# EAGLE board A10kalsch (EAGLE 6.5.0)
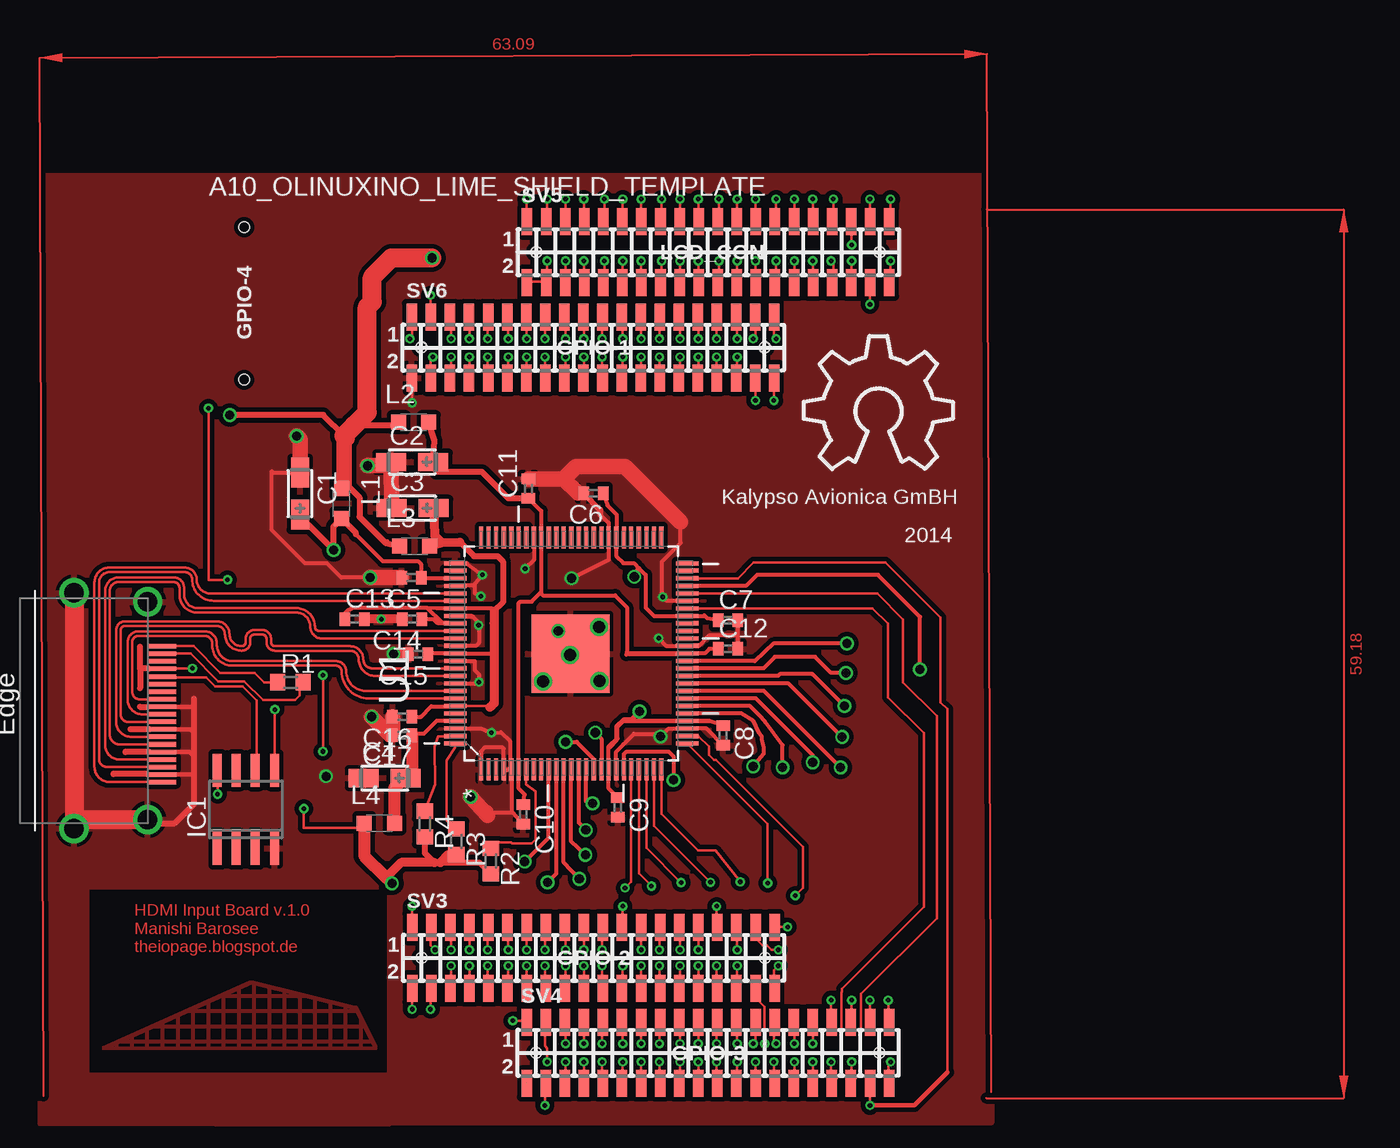
[diagram p2: board, top side]
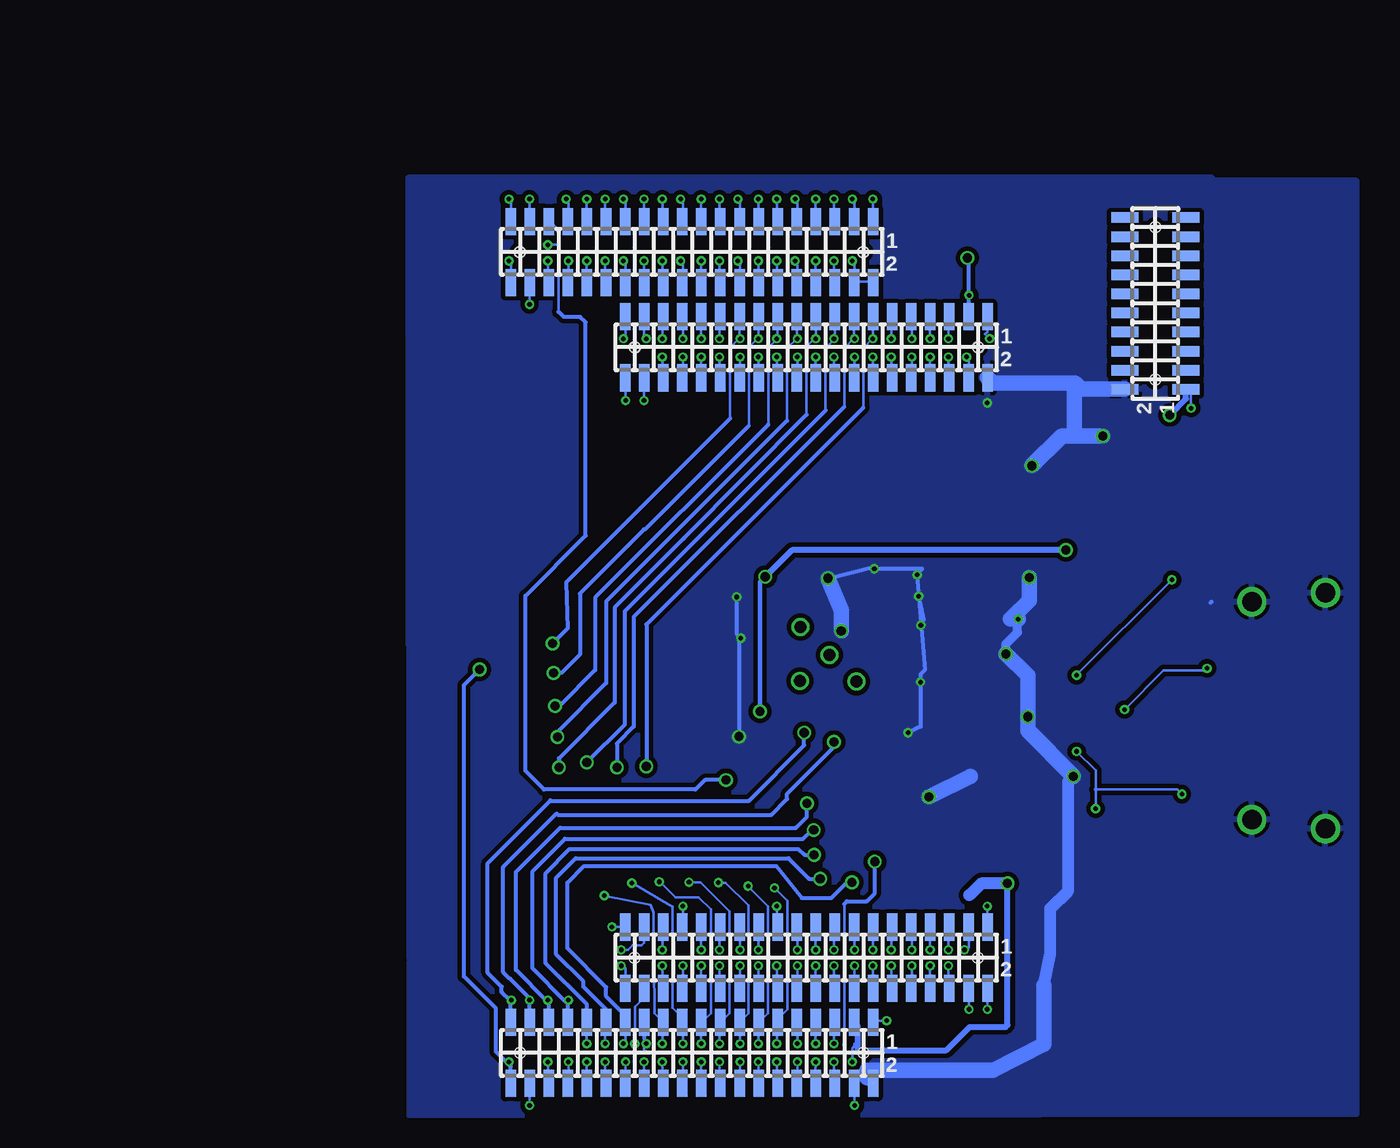
[diagram p3: board, bottom side, seen from below]

No outline drawn. Coordinates in mm, seen from the top.
Copper layers (1*16): Top 0.035mm / dielectric 1.5mm / Bottom 0.035mm
Design rules "ITEADstudio_DRC": minimum track width 6mil, minimum drill 12mil, track to track 6mil, track to pad 6mil, pad to pad 6mil, via to via 6mil, smd to smd 0mil, copper to edge 10mil, drill to drill 10mil, minimum pad ring 10mil, minimum via ring 6mil, stop-mask expansion 2mil, vias tented up to drill 100mil, thermal gap 10mil

## Footprints (pad centres in the part's own frame; a part is rotated, then mirrored left to right if it is on the bottom)
A10_OLINUXINO_LIME_SHIELD = smd 0.7 x 1.8 bottom: 1-1 -11.874,22.416; 1-2 -11.874,18.352; 1-3 -10.604,22.416; 1-4 -10.604,18.352; 1-5 -9.335,22.416; 1-6 -9.335,18.352; 1-7 -8.065,22.416; 1-8 -8.065,18.352; 1-9 -6.795,22.416; 1-10 -6.795,18.352; 1-11 -5.524,22.416; 1-12 -5.524,18.352; 1-13 -4.255,22.416; 1-14 -4.255,18.352; 1-15 -2.985,22.416; 1-16 -2.985,18.352; 1-17 -1.714,22.416; 1-18 -1.714,18.352; 1-19 -0.445,22.416; 1-20 -0.445,18.352; 1-21 0.826,22.416; 1-22 0.826,18.352; 1-23 2.095,22.416; 1-24 2.095,18.352; 1-25 3.365,22.416; 1-26 3.365,18.352; 1-27 4.636,22.416; 1-28 4.636,18.352; 1-29 5.905,22.416; 1-30 5.905,18.352; 1-31 7.176,22.416; 1-32 7.176,18.352; 1-33 8.445,22.416; 1-34 8.445,18.352; 1-35 9.716,22.416; 1-36 9.716,18.352; 1-37 10.986,22.416; 1-38 10.986,18.352; 1-39 12.255,22.416; 1-40 12.255,18.352; 2-1 -11.874,-18.224; 2-2 -11.874,-22.288; 2-3 -10.604,-18.224; 2-4 -10.604,-22.288; 2-5 -9.335,-18.224; 2-6 -9.335,-22.288; 2-7 -8.065,-18.224; 2-8 -8.065,-22.288; 2-9 -6.795,-18.224; 2-10 -6.795,-22.288; 2-11 -5.524,-18.224; 2-12 -5.524,-22.288; 2-13 -4.255,-18.224; 2-14 -4.255,-22.288; 2-15 -2.985,-18.224; 2-16 -2.985,-22.288; 2-17 -1.714,-18.224; 2-18 -1.714,-22.288; 2-19 -0.445,-18.224; 2-20 -0.445,-22.288; 2-21 0.826,-18.224; 2-22 0.826,-22.288; 2-23 2.095,-18.224; 2-24 2.095,-22.288; 2-25 3.365,-18.224; 2-26 3.365,-22.288; 2-27 4.636,-18.224; 2-28 4.636,-22.288; 2-29 5.905,-18.224; 2-30 5.905,-22.288; 2-31 7.176,-18.224; 2-32 7.176,-22.288; 2-33 8.445,-18.224; 2-34 8.445,-22.288; 2-35 9.716,-18.224; 2-36 9.716,-22.288; 2-37 10.986,-18.224; 2-38 10.986,-22.288; 2-39 12.255,-18.224; 2-40 12.255,-22.288; 3-1 -4.255,-24.575; 3-2 -4.255,-28.639; 3-3 -2.985,-24.575; 3-4 -2.985,-28.639; 3-5 -1.714,-24.575; 3-6 -1.714,-28.639; 3-7 -0.445,-24.575; 3-8 -0.445,-28.639; 3-9 0.826,-24.575; 3-10 0.826,-28.639; 3-11 2.095,-24.575; 3-12 2.095,-28.639; 3-13 3.365,-24.575; 3-14 3.365,-28.639; 3-15 4.636,-24.575; 3-16 4.636,-28.639; 3-17 5.905,-24.575; 3-18 5.905,-28.639; 3-19 7.176,-24.575; 3-20 7.176,-28.639; 3-21 8.445,-24.575; 3-22 8.445,-28.639; 3-23 9.716,-24.575; 3-24 9.716,-28.639; 3-25 10.986,-24.575; 3-26 10.986,-28.639; 3-27 12.255,-24.575; 3-28 12.255,-28.639; 3-29 13.525,-24.575; 3-30 13.525,-28.639; 3-31 14.796,-24.575; 3-32 14.796,-28.639; 3-33 16.066,-24.575; 3-34 16.066,-28.639; 3-35 17.335,-24.575; 3-36 17.335,-28.639; 3-37 18.605,-24.575; 3-38 18.605,-28.639; 3-39 19.875,-24.575; 3-40 19.875,-28.639; D-1 -4.255,28.765; D-2 -4.255,24.701; D-3 -2.985,28.765; D-4 -2.985,24.701; D-5 -1.714,28.765; D-6 -1.714,24.701; D-7 -0.445,28.765; D-8 -0.445,24.701; D-9 0.826,28.765; D-10 0.826,24.701; D-11 2.095,28.765; D-12 2.095,24.701; D-13 3.365,28.765; D-14 3.365,24.701; D-15 4.636,28.765; D-16 4.636,24.701; D-17 5.905,28.765; D-18 5.905,24.701; D-19 7.176,28.765; D-20 7.176,24.701; D-21 8.445,28.765; D-22 8.445,24.701; D-23 9.716,28.765; D-24 9.716,24.701; D-25 10.986,28.765; D-26 10.986,24.701; D-27 12.255,28.765; D-28 12.255,24.701; D-29 13.525,28.765; D-30 13.525,24.701; D-31 14.796,28.765; D-32 14.796,24.701; D-33 16.066,28.765; D-34 16.066,24.701; D-35 17.335,28.765; D-36 17.335,24.701; D-37 18.605,28.765; D-38 18.605,24.701; D-39 19.875,28.765; D-40 19.875,24.701 | smd 1.8 x 0.7 bottom: 4-1 -25.082,17.59; 4-2 -21.018,17.59; 4-3 -25.082,18.86; 4-4 -21.018,18.86; 4-5 -25.082,20.13; 4-6 -21.018,20.13; 4-7 -25.082,21.399; 4-8 -21.018,21.399; 4-9 -25.082,22.669; 4-10 -21.018,22.669; 4-11 -25.082,23.939; 4-12 -21.018,23.939; 4-13 -25.082,25.209; 4-14 -21.018,25.209; 4-15 -25.082,26.48; 4-16 -21.018,26.48; 4-17 -25.082,27.75; 4-18 -21.018,27.75; 4-19 -25.082,29.02; 4-20 -21.018,29.02 | hole 0.7: -11.239,20.384; 11.62,20.384; -11.239,-20.256; 11.62,-20.256; -3.619,-26.607; 19.241,-26.607; -3.619,26.733; 19.241,26.733; -23.05,18.224; -23.05,28.384
CT3216 = smd 2 x 1.2: + 1.4,0; - -1.4,0
C0402 = smd 0.7 x 0.9: 1 -0.65,0; 2 0.65,0
FCI-HDMI = drill 1.3: 1 1.1,7.85; 2 -3.8,7.25; 3 1.1,-7.85; 4 -3.8,-7.25 | smd 1.9 x 0.3: P$1 -4.76,4.75; P$2 -4.76,4.25; P$3 -4.76,3.75; P$4 -4.76,3.25; P$5 -4.76,2.75; P$6 -4.76,2.25; P$7 -4.76,1.75; P$8 -4.76,1.25; P$9 -4.76,0.75; P$10 -4.76,0.25; P$11 -4.76,-0.25; P$12 -4.76,-0.75; P$13 -4.76,-1.25; P$14 -4.76,-1.75; P$15 -4.76,-2.25; P$16 -4.76,-2.8; P$17 -4.76,-3.3; P$18 -4.76,-3.8; P$19 -4.76,-4.3
SO-08 = smd 0.6 x 2.2: 1 -1.905,-2.6; 2 -0.635,-2.6; 3 0.635,-2.6; 4 1.905,-2.6; 5 1.905,2.6; 6 0.635,2.6; 7 -0.635,2.6; 8 -1.905,2.6
L2012C = smd 1 x 1: 1 -1,0; 2 1,0
R0603 = smd 1 x 1.1: 1 -0.85,0; 2 0.85,0
YA-V36P-2X20-LF = smd 0.7 x 1.8: 1 -12.065,2.032; 2 -12.065,-2.032; 3 -10.795,2.032; 4 -10.795,-2.032; 5 -9.525,2.032; 6 -9.525,-2.032; 7 -8.255,2.032; 8 -8.255,-2.032; 9 -6.985,2.032; 10 -6.985,-2.032; 11 -5.715,2.032; 12 -5.715,-2.032; 13 -4.445,2.032; 14 -4.445,-2.032; 15 -3.175,2.032; 16 -3.175,-2.032; 17 -1.905,2.032; 18 -1.905,-2.032; 19 -0.635,2.032; 20 -0.635,-2.032; 21 0.635,2.032; 22 0.635,-2.032; 23 1.905,2.032; 24 1.905,-2.032; 25 3.175,2.032; 26 3.175,-2.032; 27 4.445,2.032; 28 4.445,-2.032; 29 5.715,2.032; 30 5.715,-2.032; 31 6.985,2.032; 32 6.985,-2.032; 33 8.255,2.032; 34 8.255,-2.032; 35 9.525,2.032; 36 9.525,-2.032; 37 10.795,2.032; 38 10.795,-2.032; 39 12.065,2.032; 40 12.065,-2.032 | hole 0.7: -11.43,0; 11.43,0
QFP50P1600X1600X120-101N = smd 1.473 x 0.279: 1 -7.722,5.994; 2 -7.722,5.512; 3 -7.722,5.004; 4 -7.722,4.496; 5 -7.722,3.988; 6 -7.722,3.505; 7 -7.722,2.997; 8 -7.722,2.489; 9 -7.722,2.007; 10 -7.722,1.499; 11 -7.722,0.991; 12 -7.722,0.508; 13 -7.722,0; 14 -7.722,-0.508; 15 -7.722,-0.991; 16 -7.722,-1.499; 17 -7.722,-2.007; 18 -7.722,-2.489; 19 -7.722,-2.997; 20 -7.722,-3.505; 21 -7.722,-3.988; 22 -7.722,-4.496; 23 -7.722,-5.004; 24 -7.722,-5.512; 25 -7.722,-5.994; 51 7.722,-5.994; 52 7.722,-5.512; 53 7.722,-5.004; 54 7.722,-4.496; 55 7.722,-3.988; 56 7.722,-3.505; 57 7.722,-2.997; 58 7.722,-2.489; 59 7.722,-2.007; 60 7.722,-1.499; 61 7.722,-0.991; 62 7.722,-0.508; 63 7.722,0; 64 7.722,0.508; 65 7.722,0.991; 66 7.722,1.499; 67 7.722,2.007; 68 7.722,2.489; 69 7.722,2.997; 70 7.722,3.505; 71 7.722,3.988; 72 7.722,4.496; 73 7.722,5.004; 74 7.722,5.512; 75 7.722,5.994 | smd 0.279 x 1.473: 26 -5.994,-7.722; 27 -5.512,-7.722; 28 -5.004,-7.722; 29 -4.496,-7.722; 30 -3.988,-7.722; 31 -3.505,-7.722; 32 -2.997,-7.722; 33 -2.489,-7.722; 34 -2.007,-7.722; 35 -1.499,-7.722; 36 -0.991,-7.722; 37 -0.508,-7.722; 38 0,-7.722; 39 0.508,-7.722; 40 0.991,-7.722; 41 1.499,-7.722; 42 2.007,-7.722; 43 2.489,-7.722; 44 2.997,-7.722; 45 3.505,-7.722; 46 3.988,-7.722; 47 4.496,-7.722; 48 5.004,-7.722; 49 5.512,-7.722; 50 5.994,-7.722; 76 5.994,7.722; 77 5.512,7.722; 78 5.004,7.722; 79 4.496,7.722; 80 3.988,7.722; 81 3.505,7.722; 82 2.997,7.722; 83 2.489,7.722; 84 2.007,7.722; 85 1.499,7.722; 86 0.991,7.722; 87 0.508,7.722; 88 0,7.722; 89 -0.508,7.722; 90 -0.991,7.722; 91 -1.499,7.722; 92 -2.007,7.722; 93 -2.489,7.722; 94 -2.997,7.722; 95 -3.505,7.722; 96 -3.988,7.722; 97 -4.496,7.722; 98 -5.004,7.722; 99 -5.512,7.722; 100 -5.994,7.722 | smd 5.207 x 5.207: 101 -0.025,0.051

## Placement (x,y rotation side)
A10_OLINUXINO_LIME_SHIELD  A10_OLINUXINO_LIME_SHIELD_TEMPLATE  [A10_OLINUXINO_LIME_SHIELD]  40.67,31.93 0 top
C1  22uF  [CT3216]  21.34,42.57 270 top
C2  22uF  [CT3216]  28.8,44.68 0 top
C3  22uF  [CT3216]  28.83,41.61 0 top
C4  22uF  [CT3216]  26.97,23.62 0 top
C5  0.01uf  [C0402]  28.75,36.98 180 top
C6  0.01uf  [C0402]  40.87,42.6 180 top
C7  0.01uf  [C0402]  49.83,34.14 0 top
C8  0.01uf  [C0402]  49.5,26.47 270 top
C9  0.01uf  [C0402]  42.49,21.67 270 top
C10  0.01uf  [C0402]  36.2,21.21 270 top
C11  0.01uf  [C0402]  36.55,42.9 90 top
C12  0.01uf  [C0402]  49.83,32.23 0 top
C13  0.01uf  [C0402]  24.97,34.21 0 top
C14  0.01uf  [C0402]  28.8,34.21 180 top
C15  0.01uf  [C0402]  29.21,31.88 180 top
C16  0.01uf  [C0402]  28.14,27.71 180 top
C17  [C0402]  28.14,26.49 180 top
HDMI  HDMI  [FCI-HDMI]  7.39,28.12 180 top
IC1  24AA02SN  [SO-08]  17.73,21.54 0 top
L1  0.082uH  [L2012C]  24.1,41.91 270 top
L2  0.082uH  [L2012C]  28.91,47.32 0 top
L3  0.082uH  [L2012C]  28.96,39.07 0 top
L4  0.082uH  [L2012C]  26.62,20.62 0 top
R1  4.7K  [R0603]  20.7,30 0 top
R2  4.7K  [R0603]  34.04,18.11 270 top
R3  4.7K  [R0603]  31.75,19.41 270 top
R4  4.7K  [R0603]  29.64,20.57 270 top
SV3  ML40YA-V36P-2X20-LF  [YA-V36P-2X20-LF]  40.87,11.66 0 top
SV4  ML40YA-V36P-2X20-LF  [YA-V36P-2X20-LF]  48.49,5.33 0 top
SV5  ML40YA-V36P-2X20-LF  [YA-V36P-2X20-LF]  48.51,58.65 0 top
SV6  ML40YA-V36P-2X20-LF  [YA-V36P-2X20-LF]  40.84,52.3 0 top
U1  TFP401APZP  [QFP50P1600X1600X120-101N]  39.4,31.93 90 top
U$2  [OSHW_10X350_NOTEXT]  54.89,44.2 0 top

## Tracks (layer width: path | path; a pad name or v marks a point on that pad's centre or on a via)
B0  (via drill 0.3, 0.61 pad 0.25)
  Top 0.152: SV4.25 51.66,6.1 v51.51,5.94
  Top 0.254: U1.10 37.9,19.66 v36.3,18.06
  Bottom 0.152: 38.33,5.92 38.33,15.24 | 51.65,6.31 51.65,5.94 | 51.65,5.94 51.65,5.52 51.51,5.38 38.33,5.38 38.25,5.31 | 51.65,5.94 v51.51,5.94 | 51.66,5.94 51.65,5.94
  Bottom 0.254: A10_OLINUXINO_LIME_SHIELD.3-25 51.65,6.31 | 38.25,5.31 38.33,5.92 | 38.33,15.24 38.15,15.42 36.83,15.42 36.3,15.95 v36.3,18.06
B1  (via drill 0.3, 0.61 pad 0.25)
  Top 0.152: v53.03,5.94 52.88,6.1 52.88,7.32 SV4.27
  Top 0.254: v37.82,16.69 38.41,17.27 U1.11
  Bottom 0.152: v53.03,5.94 52.88,6.1 52.88,7.32 A10_OLINUXINO_LIME_SHIELD.3-27
  Bottom 0.254: A10_OLINUXINO_LIME_SHIELD.3-27 52.92,7.84 54.18,9.09 54.18,9.7 56.77,12.29 56.77,16.66 55.65,17.78 42.88,17.78 41.15,15.62 41.12,15.65 39.19,15.65 38.15,16.69 v37.82,16.69
B2  (via drill 0.3, 0.61 pad 0.25)
  Top 0.152: v54.25,5.94 54.25,7.32 SV4.29
  Top 0.254: v39.93,16.92 38.89,18.01 U1.12
  Bottom 0.152: v54.25,5.94 54.25,7.32 A10_OLINUXINO_LIME_SHIELD.3-29
  Bottom 0.254: A10_OLINUXINO_LIME_SHIELD.3-29 54.19,8.22 55.7,9.73 55.7,10.08 57.51,11.89 57.51,16.99 56.21,18.29 42.04,18.29 40.66,16.92 v39.93,16.92
B3  (via drill 0.3, 0.61 pad 0.25)
  Top 0.152: v55.47,5.94 SV4.31
  Top 0.254: v40.34,18.52 39.4,19.41 U1.13
  Bottom 0.152: v55.47,5.94 55.47,7.32 A10_OLINUXINO_LIME_SHIELD.3-31
  Bottom 0.254: A10_OLINUXINO_LIME_SHIELD.3-31 55.46,8.55 58.22,11.3 58.22,17.3 56.62,18.9 41.4,18.9 40.97,18.52 v40.34,18.52
B4  (via drill 0.3, 0.61 pad 0.25)
  Top 0.152: v56.69,8.84 56.69,7.47 SV4.33
  Top 0.254: v40.36,20.17 39.9,20.65 U1.14
  Bottom 0.152: v56.69,8.84 56.84,8.84 56.91,8.78
  Bottom 0.254: A10_OLINUXINO_LIME_SHIELD.3-33 56.73,8.6 56.91,8.78 59.08,10.95 59.08,17.42 56.92,19.58 41.07,19.58 40.46,20.17 v40.36,20.17
B5  (via drill 0.3, 0.61 pad 0.25)
  Top 0.152: v58.06,8.84 58.06,7.47 SV4.35
  Top 0.254: v40.82,21.95 40.39,22.07 U1.15
  Bottom 0.152: v58.06,8.84 58.13,8.78
  Bottom 0.254: A10_OLINUXINO_LIME_SHIELD.3-35 58,8.65 58.13,8.78 60.2,10.85 60.2,17.37 57.25,20.32 41.55,20.32 40.82,21.06 v40.82,21.95
B6  (via drill 0.3, 0.61 pad 0.25)
  Top 0.152: v59.28,8.84 SV4.37
  Top 0.254: v39.01,26.04 39.75,26.04 40.89,24.89 U1.16
  Bottom 0.152: v59.28,8.84 59.27,8.95
  Bottom 0.254: A10_OLINUXINO_LIME_SHIELD.3-37 59.27,8.95 60.58,10.26 60.6,10.26 61.04,10.69 61.04,17.7 57.48,21.26 57.4,21.18 43.18,21.18 42.14,22.23 42.14,22.58 39.01,25.7 v39.01,26.04
B7  (via drill 0.3, 0.61 pad 0.25)
  Top 0.152: v60.5,8.84 60.5,7.47 SV4.39
  Top 0.254: v41,26.64 41.4,26.24 U1.17
  Bottom 0.152: v60.5,8.84 60.55,8.79
  Bottom 0.254: A10_OLINUXINO_LIME_SHIELD.3-39 60.54,8.78 60.55,8.79 61.14,9.37 61.14,9.73 62.08,10.67 62.08,17.96 57.89,22.15 57.86,22.12 44.68,22.12 41,25.81 v41,26.64
CK  (via drill 0.3)
  Top 0.152: U1.44 59.46,34.92 60.48,33.91 60.48,29.01 62.87,26.62 62.87,15.04 57.43,9.6 57.43,9.4 57.38,9.35 57.38,3.94 SV4.34 56.69,3.35 v56.69,4.72
  Bottom 0.152: v56.69,4.72 56.69,3.35 A10_OLINUXINO_LIME_SHIELD.3-34
DE  (via drill 0.3)
  Top 0.152: U1.46 59.77,35.92 61.49,34.19 61.49,30 63.73,27.76 63.73,14.3 58.67,9.25 58.67,3.96 58.06,3.35 | 58.06,3.35 v58.06,4.72 | 58.06,3.35 SV4.36
  Bottom 0.152: v58.06,4.72 58.06,3.35 A10_OLINUXINO_LIME_SHIELD.3-36
EINT28/SPI1_CS0/UART2_RTS/PI16  (via drill 0.3)
  Top 0.152: v53.19,11.12 52.88,10.82 52.88,9.75 SV3.40
  Bottom 0.152: v53.19,11.12 53.03,11.12 52.88,10.97 52.88,9.75 A10_OLINUXINO_LIME_SHIELD.2-40
EINT29/SPI1_CLK/UART2_CTS/PI17  (via drill 0.3)
  Top 0.152: SV3.38 51.66,8.99 52.27,8.38 v52.27,5.94
  Bottom 0.152: v52.27,5.94 52.27,8.38 51.66,8.99 51.66,9.6 A10_OLINUXINO_LIME_SHIELD.2-38
EINT30/SPI1_MOSI/UART2_TX/PI18  (via drill 0.3)
  Top 0.152: v50.44,11.12 50.44,9.75 SV3.36
  Bottom 0.152: v50.44,11.12 50.44,9.75 A10_OLINUXINO_LIME_SHIELD.2-36
EINT31/SPI1_MISO/UART2_RX/PI19  (via drill 0.3)
  Top 0.152: v49.07,11.12 49.07,9.75 SV3.34
  Bottom 0.152: v49.07,11.12 49.07,9.75 A10_OLINUXINO_LIME_SHIELD.2-34
G0  (via drill 0.3, 0.61 pad 0.25)
  Top 0.152: v58.06,59.13 58.06,60.66 SV5.35
  Top 0.254: U1.20 42.9,25.22 43.08,25.4 45.87,25.4 46.2,25.07 v46.2,23.5
  Bottom 0.152: 57.35,54.69 57.35,59.13 | 57.35,59.13 57.35,60.05 | 57.35,59.13 v58.06,59.13 | 57.3,59.13 57.35,59.13
  Bottom 0.254: v46.2,23.5 47.6,23.5 48.23,22.86 58.32,22.86 59.56,24.11 59.56,35.76 55.55,39.78 55.55,53.98 55.91,54.33 57,54.33 57.35,54.69 | 57.35,60.05 A10_OLINUXINO_LIME_SHIELD.D-35
G1  (via drill 0.3)
  Top 0.152: v42.98,16.31 43.38,16.71 U1.21 | v42.82,5.94 42.82,7.32 SV4.11
  Bottom 0.152: v42.98,16.31 42.11,15.44 42.11,8.23 42.76,7.58 A10_OLINUXINO_LIME_SHIELD.3-11 42.82,7.32 v42.82,5.94
G2  (via drill 0.3)
  Top 0.152: v44.73,16.43 43.89,17.27 U1.22 | v44.04,5.94 SV4.13
  Bottom 0.152: v44.73,16.43 44.73,16.41 43.41,15.09 43.41,7.98 A10_OLINUXINO_LIME_SHIELD.3-13 44.04,7.32 v44.04,5.94
G3  (via drill 0.3)
  Top 0.152: U1.23 44.4,18.97 v46.71,16.66 | v45.26,5.94 45.26,7.32 SV4.15
  Bottom 0.152: v46.71,16.66 46.23,16.66 44.7,15.14 44.7,7.95 A10_OLINUXINO_LIME_SHIELD.3-15 45.26,7.32 v45.26,5.94
G4  (via drill 0.3)
  Top 0.152: U1.24 44.91,20.45 v48.67,16.69 | v46.63,5.94 46.63,7.32 SV4.17
  Bottom 0.152: v48.67,16.69 47.9,16.69 45.97,14.76 45.97,7.95 A10_OLINUXINO_LIME_SHIELD.3-17 46.63,7.32 v46.63,5.94
G5  (via drill 0.3)
  Top 0.152: U1.25 45.39,21.23 47.83,18.8 49,18.8 v50.65,16.71 | v47.85,5.94 SV4.19
  Bottom 0.152: v50.65,16.71 50.6,16.71 49.58,15.7 48.03,15.7 47.22,14.88 47.22,7.98 A10_OLINUXINO_LIME_SHIELD.3-19 47.85,7.32 v47.85,5.94
G6  (via drill 0.3)
  Top 0.152: U1.26 52.48,20.57 v52.48,16.64 | v49.07,5.94 49.07,7.32 SV4.21
  Bottom 0.152: v52.48,16.64 49.94,15.16 49.76,15.09 49.76,8.33 49.11,7.68 A10_OLINUXINO_LIME_SHIELD.3-21 49.07,7.32 v49.07,5.94
G7  (via drill 0.3)
  Top 0.152: U1.27 47.88,26.42 48.56,25.73 48.56,25.17 48.9,24.84 49.02,24.84 54.81,19.05 54.81,16.31 v54.3,15.8 | v50.44,5.94 50.44,7.32 SV4.23
  Bottom 0.152: v54.3,15.8 51.23,15.19 51.03,14.68 50.98,7.95 A10_OLINUXINO_LIME_SHIELD.3-23 50.44,7.32 v50.44,5.94
GND  (via drill 0.3, 0.3 pad 0.25, 0.6 pad 0.25, 0.61 pad 0.25)
  Top 0.152: HDMI.P$2 13.04,23.87 | v28.8,48.62 28.8,50.14 SV6.2
  Top 0.254: C12.2 50.48,33.12 | 50.48,33.12 C7.2 | 50.48,33.12 50.46,33.15 48.62,33.15 47.9,32.44 U1.39 45.72,32.44 v45.21,32.94 | C8.2 49.57,25.74 48.39,26.92 U1.28 45.87,26.92 v45.34,26.39 45.16,26.57 43.56,26.57 42.88,25.88 42.88,25.86 42.39,25.38 U1.19 | 11.38,20.62 10.79,21.21 10.85,21.21 HDMI.2 | U1.45 45.74,35.43 v45.49,35.69 45.44,35.74 45.44,38.05 46.69,39.29 46.69,40.66 | U1.76 32.44,37.92 v33.48,37.16 32.97,36.55 | 32.97,36.55 32.87,36.45 31.7,36.45 U1.79 | 32.97,36.55 32.97,35.94 v33.38,35.74 | U1.87 33.05,32.44 33.25,32.64 33.25,33.96 32.82,34.39 32.18,34.39 32.21,34.42 32.79,34.42 33.22,33.98 v33.22,33.81 32.82,34.42 U1.83 | U1.5 35.31,24.31 35.31,26.09 34.72,26.67 v34.09,26.64 33.38,26.92 U1.98 | U1.5 U1.4 34.9,25.58 34.82,25.65 33.63,25.65 33.38,25.4 33.38,24.23 U1.1 | U1.89 32.94,31.42 32.97,31.39 32.97,30.81 33.25,30.53 v33.25,30.02 33.15,29.92 U1.92 | U1.68 36.91,38.15 v36.32,37.57 | v39.42,36.93 41.88,38.15 U1.58 41.88,40.62 41.33,41.17 | 33.73,21.34 35.38,21.34 | 35.38,21.34 35.49,21.34 C10.2 | U1.5 35.41,21.36 35.38,21.34 | C5.2 24.08,36.98 23.14,37.92 21.67,37.92 19.46,40.13 19.46,44.07 19.55,43.97 C1.-
  Top 0.305: HDMI.P$11 14.17,28.37 14.28,28.47 | HDMI.P$8 14.05,26.87 14.28,26.64 | HDMI.P$5 13.98,25.37 14.28,25.07 | HDMI.P$2 14.26,23.87 14.28,23.85
  Top 0.406: C6.2 41.33,41.49 41.33,41.17 | 11.38,20.62 12.98,20.62 14.28,21.92 14.28,23.85 14.28,25.07 14.28,26.64 14.28,28.47 14.28,28.91
  Top 0.61: C14.2 v26.75,34.21 C13.2 | C15.2 27.58,31.88 v27.56,31.9
  Top 1.016: C16.2 C17.2 27.33,26.49 v26.11,27.71 | C5.2 v26.01,36.98 | C3.- C2.- 27.33,44.42 v25.83,44.42 | v21.11,46.41 21.34,46.18 C1.- | 46.69,40.66 42.98,44.37 39.7,44.37 38.88,43.55 | 38.88,43.55 C11.2 | 38.88,43.55 39.83,42.6 | v32.69,22.38 33.83,21.16 33.73,21.34 | U1.101 39.34,32.61 v38.53,33.43
  Top 1.27: HDMI.2 6.89,20.87 HDMI.1 HDMI.3
  Bottom 0.254: v45.49,35.69 45.49,33.22 v45.21,32.94 45.34,32.82 v45.34,26.39 | v33.38,35.74 33.05,34.19 v33.22,33.81 | v34.09,26.64 33.25,27.05 v33.25,30.02 33.25,30.53 32.97,30.81 v33.48,37.16 33.15,37.57 v36.32,37.57 36.42,37.67 v39.42,36.93 | 13.88,35.37 13.95,35.31
  Bottom 0.61: v27.56,31.9 27.56,32.56 26.8,33.33 26.8,34.16 v26.75,34.21
  Bottom 0.813: 25.03,9.84 24.61,11.94 24.61,14.94 23.42,16.13 23.42,23.39 v23.06,23.75
  Bottom 1.016: v27.56,31.9 26.11,30.45 v26.11,27.71 26.11,26.8 v23.06,23.75 | v26.01,36.98 26.01,35.46 27.25,34.21 v26.75,34.21 | v25.83,44.42 23.85,46.41 23.01,46.41 | 23.01,46.41 v21.11,46.41 | A10_OLINUXINO_LIME_SHIELD.1-2 28.45,49.94 22.99,49.94 | 22.99,49.94 23.01,49.91 23.01,46.41 | 22.99,49.94 22.57,49.52 A10_OLINUXINO_LIME_SHIELD.4-2 | 29.92,23.75 v32.69,22.38 | 25.03,9.84 25.03,5.91 28.45,4.17 36.8,4.17 36.8,3.68 | v38.53,33.43 38.53,34.8 v39.42,36.93
  pour Bottom (isolate 0.305): 13.84,63.6 67.36,63.6 67.28,1.17 4.22,1.27 4.22,63.4 13.84,63.4
  pour Top (isolate 0.305): 4.06,63.73 67.36,63.73 67.36,0.69 27.33,0.69 27.33,16.38 7.11,16.38 7.11,3.84 27.3,3.86 27.2,0.58 4.06,0.64
GPS_CLK/PI0  (via drill 0.3)
  Top 0.152: v33.83,12.19 33.83,13.56 SV3.9
  Bottom 0.152: v33.83,12.19 33.83,13.56 A10_OLINUXINO_LIME_SHIELD.2-9
GPS_MAG/PI2  (via drill 0.3)
  Top 0.152: v36.42,12.19 SV3.13
  Bottom 0.152: v36.42,12.19 36.42,13.56 A10_OLINUXINO_LIME_SHIELD.2-13
GPS_SIGN/PI1  (via drill 0.3)
  Top 0.152: v35.2,12.19 35.2,13.56 SV3.11
  Bottom 0.152: v35.2,12.19 35.2,13.56 A10_OLINUXINO_LIME_SHIELD.2-11
HPCOM/HPCOMFB  (via drill 0.3)
  Top 0.152: v37.64,51.66 37.64,50.29 SV6.16
  Bottom 0.152: v37.64,51.66 37.64,50.29 A10_OLINUXINO_LIME_SHIELD.1-16
HPOUTL  (via drill 0.3)
  Top 0.152: v36.42,51.66 36.42,50.29 SV6.14
  Bottom 0.152: v36.42,51.66 36.42,50.29 A10_OLINUXINO_LIME_SHIELD.1-14
HPOUTR  (via drill 0.3)
  Top 0.152: v39.01,51.66 39.01,50.29 SV6.18
  Bottom 0.152: v39.01,51.66 39.01,50.29 A10_OLINUXINO_LIME_SHIELD.1-18
HSCL/UART7_TX/PS2_SCK0/PI20  (via drill 0.3)
  Top 0.152: v47.85,11.12 SV3.32
  Bottom 0.152: v47.85,11.12 47.85,9.75 A10_OLINUXINO_LIME_SHIELD.2-32
HSDA/UART7_RX/PS2_SDA0/PI21  (via drill 0.3)
  Top 0.152: v46.63,11.12 46.63,9.75 SV3.30
  Bottom 0.152: v46.63,11.12 46.63,9.75 A10_OLINUXINO_LIME_SHIELD.2-30
HSYNC  (via drill 0.3)
  Top 0.152: U1.48 50.49,36.93 51.54,37.97 60.33,37.97 63.98,34.31 63.98,28.68 64.44,28.22 64.44,4.12 | 64.44,4.12 64.44,4.04 | SV4.38 v59.28,1.83 | 64.47,4.12 64.44,4.12
  Top 0.305: v59.28,1.83 62.23,1.83 64.44,4.04
  Bottom 0.152: v59.28,1.83 59.28,3.2 A10_OLINUXINO_LIME_SHIELD.3-38
I2S_BCLK/AC97_BCLK/PB6  (via drill 0.3)
  Top 0.152: v42.82,4.72 42.82,3.35 SV4.12
  Bottom 0.152: v42.82,4.72 42.82,3.35 A10_OLINUXINO_LIME_SHIELD.3-12
I2S_DI/AC97_DI/SPDIF_DI/PB12  (via drill 0.3)
  Top 0.152: v49.07,4.72 49.07,3.35 SV4.22
  Bottom 0.152: v49.07,4.72 49.07,3.35 A10_OLINUXINO_LIME_SHIELD.3-22
I2S_DO0/AC97_DO/PB8/SATA-PWR-EN  (via drill 0.3)
  Top 0.152: v45.26,4.72 45.26,3.35 SV4.16
  Bottom 0.152: v45.26,4.72 45.26,3.35 A10_OLINUXINO_LIME_SHIELD.3-16
I2S_DO2/PB10  (via drill 0.3)
  Top 0.152: v46.63,4.72 46.63,3.35 SV4.18
  Bottom 0.152: v46.63,4.72 46.63,3.35 A10_OLINUXINO_LIME_SHIELD.3-18
I2S_DO3/PB11  (via drill 0.3)
  Top 0.152: SV4.20 v47.85,4.72
  Bottom 0.152: v47.85,4.72 47.85,3.35 A10_OLINUXINO_LIME_SHIELD.3-20
I2S_LRCK/AC97_SYNC/PB7  (via drill 0.3)
  Top 0.152: SV4.14 v44.04,4.72
  Bottom 0.152: v44.04,4.72 44.04,3.35 A10_OLINUXINO_LIME_SHIELD.3-14
I2S_MCLK/AC97_MCLK/PB5  (via drill 0.3)
  Top 0.152: v41.45,4.72 41.45,3.35 SV4.10
  Bottom 0.152: v41.45,4.72 41.45,3.35 A10_OLINUXINO_LIME_SHIELD.3-10
IR0_RX/PB4  (via drill 0.3)
  Top 0.152: SV4.8 v40.23,4.72
  Bottom 0.152: v40.23,4.72 40.23,3.35 A10_OLINUXINO_LIME_SHIELD.3-8
IR0_TX/SPDIF_MCLK/STANBYWFI/PB3  (via drill 0.3)
  Top 0.152: v39.01,4.72 39.01,3.35 SV4.6
  Bottom 0.152: v39.01,4.72 39.01,3.35 A10_OLINUXINO_LIME_SHIELD.3-6
JTAG_CK0/SPI2_CLK/PB15  (via drill 0.3)
  Top 0.152: v52.88,4.72 52.88,3.35 SV4.28
  Bottom 0.152: v52.88,4.72 52.88,3.35 A10_OLINUXINO_LIME_SHIELD.3-28
JTAG_DI0/SPI2_MISO/PB17  (via drill 0.3)
  Top 0.152: SV4.32 v55.47,4.72
  Bottom 0.152: v55.47,4.72 55.47,3.35 A10_OLINUXINO_LIME_SHIELD.3-32
JTAG_DO0/SPI2_MOSI/PB16  (via drill 0.3)
  Top 0.152: v54.25,4.72 54.25,3.35 SV4.30
  Bottom 0.152: v54.25,4.72 54.25,3.35 A10_OLINUXINO_LIME_SHIELD.3-30
JTAG_MS0/SPI2_CS0/PB14  (via drill 0.3)
  Top 0.152: SV4.26 v51.66,4.72
  Bottom 0.152: v51.66,4.72 51.66,3.35 A10_OLINUXINO_LIME_SHIELD.3-26
LCD0_CLK/SMC_VCCEN/PD24  (via drill 0.3)
  Top 0.152: v55.47,62.18 55.47,60.81 SV5.31
  Bottom 0.152: v55.47,62.18 55.47,60.81 A10_OLINUXINO_LIME_SHIELD.D-31
LCD0_D0/LVDS0_VP0/PD0  (via drill 0.3)
  Top 0.152: v49.23,62.18 49.23,60.81 SV5.21
  Bottom 0.152: v49.23,62.18 49.07,62.03 49.07,60.81 A10_OLINUXINO_LIME_SHIELD.D-21
LCD0_D1/LVDS0_VN0/PD1  (via drill 0.3)
  Top 0.152: v49.23,58.06 49.23,56.69 SV5.22
  Bottom 0.152: v49.23,58.06 49.07,57.91 49.07,56.69 A10_OLINUXINO_LIME_SHIELD.D-22
LCD0_D2/LVDS0_VP1/PD2  (via drill 0.3)
  Top 0.152: v50.44,62.18 50.44,60.81 SV5.23
  Bottom 0.152: v50.44,62.18 50.44,60.81 A10_OLINUXINO_LIME_SHIELD.D-23
LCD0_D3/LVDS0_VN1/PD3  (via drill 0.3)
  Top 0.152: v50.44,58.06 50.44,56.69 SV5.24
  Bottom 0.152: v50.44,58.06 50.44,56.69 A10_OLINUXINO_LIME_SHIELD.D-24
LCD0_D4/LVDS0_VP2/PD4  (via drill 0.3)
  Top 0.152: v51.66,62.18 51.66,60.81 SV5.25
  Bottom 0.152: v51.66,62.18 51.66,60.81 A10_OLINUXINO_LIME_SHIELD.D-25
LCD0_D5/LVDS0_VN2/PD5  (via drill 0.3)
  Top 0.152: v51.66,58.06 51.66,56.69 SV5.26
  Bottom 0.152: v51.66,58.06 51.66,56.69 A10_OLINUXINO_LIME_SHIELD.D-26
LCD0_D6/LVDS0_VPC/PD6  (via drill 0.3)
  Top 0.152: v53.03,62.18 53.03,60.81 SV5.27
  Bottom 0.152: v53.03,62.18 52.88,62.03 52.88,60.81 A10_OLINUXINO_LIME_SHIELD.D-27
LCD0_D7/LVDS0_VNC/PD7  (via drill 0.3)
  Top 0.152: v53.03,58.06 53.03,56.69 SV5.28
  Bottom 0.152: v53.03,58.06 52.88,57.91 52.88,56.69 A10_OLINUXINO_LIME_SHIELD.D-28
LCD0_D8/LVDS0_VP3/PD8  (via drill 0.3)
  Top 0.152: v44.04,62.18 44.04,60.81 SV5.13
  Bottom 0.152: v44.04,62.18 44.04,60.81 A10_OLINUXINO_LIME_SHIELD.D-13
LCD0_D9/LVDS0_VN3/PD9  (via drill 0.3)
  Top 0.152: v44.04,58.06 44.04,56.69 SV5.14
  Bottom 0.152: v44.04,58.06 44.04,56.69 A10_OLINUXINO_LIME_SHIELD.D-14
LCD0_D10/LVDS1_VP0/PD10  (via drill 0.3)
  Top 0.152: v45.41,62.18 45.41,60.81 SV5.15
  Bottom 0.152: v45.41,62.18 45.26,62.03 45.26,60.81 A10_OLINUXINO_LIME_SHIELD.D-15
LCD0_D11/LVDS1_VN0/PD11  (via drill 0.3)
  Top 0.152: v45.41,58.06 45.41,56.69 SV5.16
  Bottom 0.152: v45.41,58.06 45.26,57.91 45.26,56.69 A10_OLINUXINO_LIME_SHIELD.D-16
LCD0_D12/LVDS1_VP1/PD12  (via drill 0.3)
  Top 0.152: v46.63,62.18 46.63,60.81 SV5.17
  Bottom 0.152: v46.63,62.18 46.63,60.81 A10_OLINUXINO_LIME_SHIELD.D-17
LCD0_D13/LVDS1_VN1/PD13  (via drill 0.3)
  Top 0.152: v46.63,58.06 46.63,56.69 SV5.18
  Bottom 0.152: v46.63,58.06 46.63,56.69 A10_OLINUXINO_LIME_SHIELD.D-18
LCD0_D14/LVDS1_VP2/PD14  (via drill 0.3)
  Top 0.152: v47.85,62.18 47.85,60.81 SV5.19
  Bottom 0.152: v47.85,62.18 47.85,60.81 A10_OLINUXINO_LIME_SHIELD.D-19
LCD0_D15/LVDS1_VN2/PD15  (via drill 0.3)
  Top 0.152: v47.85,58.06 47.85,56.69 SV5.20
  Bottom 0.152: v47.85,58.06 47.85,56.69 A10_OLINUXINO_LIME_SHIELD.D-20
LCD0_D16/LVDS1_VPC/PD16  (via drill 0.3)
  Top 0.152: v39.01,62.18 39.01,60.81 SV5.5
  Bottom 0.152: v39.01,62.18 39.01,60.81 A10_OLINUXINO_LIME_SHIELD.D-5
LCD0_D17/LVDS1_VNC/PD17  (via drill 0.3)
  Top 0.152: v39.01,58.06 39.01,56.69 SV5.6
  Bottom 0.152: v39.01,58.06 39.01,56.69 A10_OLINUXINO_LIME_SHIELD.D-6
LCD0_D18/LVDS1_VP3/PD18  (via drill 0.3)
  Top 0.152: v40.23,62.18 40.23,60.81 SV5.7
  Bottom 0.152: v40.23,62.18 40.23,60.81 A10_OLINUXINO_LIME_SHIELD.D-7
LCD0_D19/LVDS1_VN3/PD19  (via drill 0.3)
  Top 0.152: v40.23,58.06 40.23,56.69 SV5.8
  Bottom 0.152: v40.23,58.06 40.23,56.69 A10_OLINUXINO_LIME_SHIELD.D-8
LCD0_D20/CSI1_MCLK/PD20  (via drill 0.3)
  Top 0.152: v41.6,62.18 41.6,60.81 SV5.9
  Bottom 0.152: v41.6,62.18 41.45,62.03 41.45,60.81 A10_OLINUXINO_LIME_SHIELD.D-9
LCD0_D21/SMC_VPPEN/PD21  (via drill 0.3)
  Top 0.152: v41.6,58.06 41.6,56.69 SV5.10
  Bottom 0.152: v41.6,58.06 41.45,57.91 41.45,56.69 A10_OLINUXINO_LIME_SHIELD.D-10
LCD0_D22/SMC_VPPPP/PD22  (via drill 0.3)
  Top 0.152: v42.82,62.18 42.82,60.81 SV5.11
  Bottom 0.152: v42.82,62.18 42.82,60.81 A10_OLINUXINO_LIME_SHIELD.D-11
LCD0_D23/SMC_DET/PD23  (via drill 0.3)
  Top 0.152: v42.82,58.06 42.82,56.69 SV5.12
  Bottom 0.152: v42.82,58.06 42.82,56.69 A10_OLINUXINO_LIME_SHIELD.D-12
LCD0_DE/SMC_RST/PD25  (via drill 0.3)
  Top 0.152: v55.47,58.06 55.47,56.69 SV5.32
  Bottom 0.152: v55.47,58.06 55.47,56.69 A10_OLINUXINO_LIME_SHIELD.D-32
LCD0_HSYNC/SMC_SLK/PD26  (via drill 0.3)
  Top 0.152: v54.25,62.18 54.25,60.81 SV5.29
  Bottom 0.152: v54.25,62.18 54.25,60.81 A10_OLINUXINO_LIME_SHIELD.D-29
LCD0_VSYNC/SMC_SDA/PD27  (via drill 0.3)
  Top 0.152: v54.25,58.06 54.25,56.69 SV5.30
  Bottom 0.152: v54.25,58.06 54.25,56.69 A10_OLINUXINO_LIME_SHIELD.D-30
LCD1_D0/ATAA0/UART3_TX/EINT0/CSI1_D0/PH0  (via drill 0.3)
  Top 0.152: SV4.7 v40.23,5.94
  Bottom 0.152: v40.23,5.94 40.23,7.32 A10_OLINUXINO_LIME_SHIELD.3-7
LCD1_D7/ATAD3/UART5_RX/MS_CLK/EINT7/CSI1_D7/PH7/I2S_DO1/PB9/USB0-DRV  (via drill 0.3)
  Top 0.152: v41.45,5.94 41.45,7.32 SV4.9
  Bottom 0.152: v41.45,5.94 41.45,7.32 A10_OLINUXINO_LIME_SHIELD.3-9
LRADC0  (via drill 0.3)
  Top 0.152: v31.39,51.66 31.39,50.29 SV6.6
  Bottom 0.152: v31.39,51.66 31.39,50.29 A10_OLINUXINO_LIME_SHIELD.1-6
LRADC1  (via drill 0.3)
  Top 0.152: v32.61,51.66 32.61,50.29 SV6.8
  Bottom 0.152: v32.61,51.66 32.61,50.29 A10_OLINUXINO_LIME_SHIELD.1-8
MICIN1  (via drill 0.3)
  Top 0.152: v33.83,51.66 33.83,50.29 SV6.10
  Bottom 0.152: v33.83,51.66 33.83,50.29 A10_OLINUXINO_LIME_SHIELD.1-10
N$1  (via drill 0.3)
  Top 0.152: v30.18,51.66 30.02,51.51 30.02,50.29 SV6.4
  Bottom 0.152: v30.18,51.66 30.02,51.51 30.02,50.29 A10_OLINUXINO_LIME_SHIELD.1-4
N$2
  Top 0.152: U1.7 36.4,23.19 37.01,22.73 37.01,19.53 36.75,19.28 35.46,19.28 35.38,19.36 34.43,19.36 R2.1
N$3
  Top 0.152: U1.100 31.67,25.65 31.09,24.79 31.09,20.81 R3.1
N$4
  Top 0.152: U1.99 30.53,26.42 30.3,25.73 30.33,23.2 R4.1
N$5  (via drill 0.3)
  Top 0.152: v37.8,62.18 37.8,60.81 SV5.3
  Bottom 0.152: v37.8,62.18 37.64,62.03 37.64,60.81 A10_OLINUXINO_LIME_SHIELD.D-3
N$6
  Top 0.254: C12.1 48.59,32.23 48.28,31.93 U1.38 | C10.1 36.3,22.53 35.89,22.94 U1.6 35.89,35.28 35.99,35.38 36.75,35.38 37.39,36.02 | C11.1 37.39,41.41 U1.67 37.39,36.02 | 37.39,36.02 37.39,35.92 37.52,35.79 42.32,35.79 43.1,35 43.1,32 43.2,31.9 47.09,31.9 U1.38 | U1.38 43.13,31.93 43.05,31.85
  Top 0.406: C11.1 35.22,42.25 33.45,44.02 30.43,44.02 C2.+ 30.28,46.11 L2.2
N$7
  Top 0.254: U1.97 30.43,27.43 29.57,26.57 28.87,26.57 C17.1
  Top 0.813: C17.1 28.79,24.16 | 28.79,24.16 28.79,24.04 C4.+ | L4.2 27.62,22.98 28.79,24.16
N$8
  Top 0.152: 33.98,28.35 33.91,28.42 U1.95
  Top 0.254: C13.1 24.32,34.58 24.59,34.85 24.66,34.85 24.74,34.92 24.79,34.92 24.77,34.98 29.77,34.98 | 29.77,34.98 30.43,34.95 31.65,34.95 | 31.65,34.95 U1.82 | C14.1 30.23,34.21 | 30.23,34.21 30.48,33.96 31.65,33.96 U1.84 | C16.1 29.39,27.71 30.07,28.4 31.65,28.4 U1.95 | 31.65,34.95 34.06,34.95 34.27,34.75 | 30.23,34.21 30.23,34.19 30.43,33.98 30.84,33.98 30.89,33.93 30.86,33.93 29.77,34.98 | 34.06,33.93 34.27,33.73 | 34.27,31.73 34.06,31.93 U1.88 29.91,31.93 C15.1
  Top 0.406: 31.98,39.34 32.92,38.41 34.49,38.41 34.85,38.05 34.85,35.33 34.27,34.75
  Top 0.61: L3.2 30.77,39.31 | 30.77,39.31 31.98,39.34 | 34.27,34.75 34.27,33.73 34.27,31.73 34.27,28.63 33.98,28.35 | C3.+ 30.3,39.78 30.77,39.31
N$9  (via drill 0.61 pad 0.25)
  Top 0.254: U1.78 29.45,36.93 C5.1 29.39,37 29.39,37.87 29.18,38.08 26.85,38.08 25.07,39.85 | C7.1 48.46,34.27 48.26,34.47 48.21,34.42 U1.43 44.91,34.42 44.35,34.98 44.35,37.16 43.92,37.59 43.56,37.95 42.88,37.95 42.39,38.43 U1.57 42.42,39.67 42.42,41.17 41.81,41.78 C6.1 | C8.1 48.58,27.43 U1.29 42.8,27.43 42.47,27.1 42.47,26.31 41.88,25.73 41.88,25.68 U1.18 41.88,22.93 C9.1
  Top 0.305: 48.58,27.43 42.85,27.43 42.44,27.03 42.44,26.29 42.47,26.26 41.88,25.68 41.94,25.68 42.42,26.16 42.42,27.05 42.9,27.53 43.41,27.53 v43.94,28.07 | v43.59,37.03 43.59,37.26 43.92,37.59
  Top 0.406: 25.07,39.85 25.07,39.95 L1.2 23.57,40.38 v23.57,38.81 21.34,41.05 C1.+
  Bottom 0.305: v43.94,28.07 43.94,36.68 v43.59,37.03
  Bottom 0.406: v23.57,38.81 41.81,38.81 v43.59,37.03
N$10  (via drill 0.3)
  Top 0.152: v36.42,62.18 36.42,60.81 SV5.1
  Bottom 0.152: v36.42,62.18 36.42,60.81 A10_OLINUXINO_LIME_SHIELD.D-1
N$11  (via drill 0.3)
  Top 0.152: SV5.2 36.58,56.69 37.64,56.69 SV5.4 37.8,56.69 v37.8,58.06
  Bottom 0.152: 37.64,56.84 37.49,56.69 36.42,56.69 A10_OLINUXINO_LIME_SHIELD.D-2 | 37.64,56.84 37.8,56.69 A10_OLINUXINO_LIME_SHIELD.D-4 37.64,56.84 | v37.8,58.06 37.64,57.91 37.64,56.84
N$12  (via drill 0.8)
  other vias: 41.25,33.68
N$13  (via drill 0.8)
  other vias: 37.52,30.05
N$14  (via drill 0.8)
  other vias: 41.27,30.1
N$15  (via drill 0.3)
  Top 0.152: v28.65,52.88 28.8,53.03 28.8,54.25 SV6.1
  Bottom 0.152: v28.65,52.88 28.96,53.19 28.8,53.34 28.8,54.25 A10_OLINUXINO_LIME_SHIELD.1-1
N$16
  Top 0.152: HDMI.P$18 14.06,31.92 15.9,30.07 17.63,30.07 18.87,28.83 21.01,28.83 21.31,29.13 21.31,29.76 R1.2
N$17
  Top 0.152: HDMI.P$19 14.24,32.42 16.03,30.63 18.31,30.63 18.95,30 R1.1
N$18
  pour Top (isolate 1.016, hatched): 18.08,10.06 25.07,8.33 26.39,5.64 8.2,5.64
N$19  (via drill 0.3)
  Top 0.152: v28.8,15.09 SV3.1
  Bottom 0.152: v28.8,15.09 28.8,13.72 A10_OLINUXINO_LIME_SHIELD.2-1
N$20  (via drill 0.3)
  Top 0.152: v28.8,8.23 SV3.2
  Bottom 0.152: v28.8,8.23 28.8,9.6 A10_OLINUXINO_LIME_SHIELD.2-2
N$21  (via drill 0.3)
  Top 0.152: v30.33,12.19 30.02,12.5 30.02,13.56 SV3.3
  Bottom 0.152: v30.33,12.19 30.18,12.19 30.02,12.34 30.02,13.56 A10_OLINUXINO_LIME_SHIELD.2-3
N$22  (via drill 0.3)
  Top 0.152: v30.02,8.23 30.02,9.6 SV3.4
  Bottom 0.152: v30.02,8.23 30.02,9.6 A10_OLINUXINO_LIME_SHIELD.2-4
N$23  (via drill 0.3)
  Top 0.152: v35.51,7.47 36.42,7.47 SV4.1
  Bottom 0.152: v35.51,7.47 36.27,7.47 A10_OLINUXINO_LIME_SHIELD.3-1
N$24  (1 unrouted)
N$25  (via drill 0.3)
  Top 0.152: v37.64,1.83 37.64,3.2 SV4.4
  Bottom 0.152: v37.64,1.83 37.64,3.2 A10_OLINUXINO_LIME_SHIELD.3-4
N$26  (via drill 0.8)
  other vias: 39.32,31.83
N$27
  Top 0.152: HDMI.P$15 12.19,30.33 15.09,30.33 15.7,29.72 17.53,29.72 18.44,28.8 18.44,24.23 IC1.6
N$28  (via drill 0.3)
  Top 0.152: v14.17,30.94 12.19,30.94 HDMI.P$16 | v19.66,28.19 19.66,24.23 IC1.5
  Bottom 0.152: v14.17,30.94 14.33,30.79 17.07,30.79 v19.66,28.19
N$29
  Top 0.406: 11.15,23.9 8.91,23.9 8.91,23.93
N$30
  Top 0.406: 11.28,25.38 9.73,25.38 9.73,25.35
N$31
  Top 0.406: 11.3,26.87 10.03,26.87 10.08,26.9
N$32
  Top 0.406: 11.28,30.91 10.69,30.91 | 10.69,30.91 10.69,32.38 | 10.69,30.91 10.69,29.62
N$33
  Top 0.406: 10.67,28.37 11.18,28.37
NC/IR0_RX/PB4  (via drill 0.3)
  Top 0.152: v56.69,58.06 56.84,57.91 56.84,56.69 SV5.34
  Bottom 0.152: v56.69,58.06 56.69,56.69 A10_OLINUXINO_LIME_SHIELD.D-34
NC/IR0_TX/SPDIF_MCLK/STANBYWFI/PB3  (via drill 0.3)
  Top 0.152: v56.84,62.18 56.84,60.81 SV5.33
  Bottom 0.152: v56.84,62.18 56.69,62.03 56.69,60.81 A10_OLINUXINO_LIME_SHIELD.D-33
NCE1/PC3/SATA-PWR-EN  (via drill 0.3)
  Top 0.152: v46.63,52.88 46.63,54.25 SV6.29
  Bottom 0.152: v46.63,52.88 46.63,54.25 A10_OLINUXINO_LIME_SHIELD.1-29
NCE3/PC18  (via drill 0.3)
  Top 0.152: v47.85,52.88 47.85,54.25 SV6.31
  Bottom 0.152: v47.85,52.88 47.85,54.25 A10_OLINUXINO_LIME_SHIELD.1-31
NCE4/SPI2_CS0/PC19  (via drill 0.3)
  Top 0.152: v49.07,52.88 49.07,54.25 SV6.33
  Bottom 0.152: v49.07,52.88 49.07,54.25 A10_OLINUXINO_LIME_SHIELD.1-33
NCE5/SPI2_CLK/PC20  (via drill 0.3)
  Top 0.152: v50.44,52.88 50.44,54.25 SV6.35
  Bottom 0.152: v50.44,52.88 50.44,54.25 A10_OLINUXINO_LIME_SHIELD.1-35
NCE6/SPI2_MOSI/PC21  (via drill 0.3)
  Top 0.152: v51.51,52.88 51.66,53.03 51.66,54.25 SV6.37
  Bottom 0.152: v51.51,52.88 51.66,53.03 51.66,54.25 A10_OLINUXINO_LIME_SHIELD.1-37
NCE7/SPI2_MISO/PC22  (via drill 0.3)
  Top 0.152: v53.03,52.88 52.88,53.03 52.88,54.25 SV6.39
  Bottom 0.152: v53.03,52.88 52.88,53.03 52.88,54.25 A10_OLINUXINO_LIME_SHIELD.1-39
NDQS/PC24  (via drill 0.3)
  Top 0.152: v51.66,48.77 51.66,50.14 SV6.38
  Bottom 0.152: v51.66,48.77 51.66,50.14 A10_OLINUXINO_LIME_SHIELD.1-38
PB2/PWM0  (via drill 0.3)
  Top 0.152: v58.06,58.06 58.06,56.69 SV5.36
  Bottom 0.152: v58.06,58.06 58.06,56.69 A10_OLINUXINO_LIME_SHIELD.D-36
PS2_SCK1/TCLKIN0/EINT26/SPI0_CS1/PI14  (via drill 0.3)
  Top 0.152: SV3.37 51.66,12.95 52.12,12.5 52.43,12.5 52.73,12.19 v53.19,12.19
  Bottom 0.152: v53.19,12.19 52.73,12.19 52.43,12.5 51.82,12.5 51.66,12.65 51.66,13.56 A10_OLINUXINO_LIME_SHIELD.2-37
PS2_SDA1/TCLKIN1/EINT27/SPI1_CS1/PI15  (via drill 0.3)
  Top 0.152: v53.8,13.72 53.03,13.72 SV3.39
  Bottom 0.152: v53.8,13.72 53.03,13.72 A10_OLINUXINO_LIME_SHIELD.2-39
PWM1/PI3  (via drill 0.3)
  Top 0.152: v37.64,12.19 37.64,13.56 SV3.15
  Bottom 0.152: v37.64,12.19 37.64,13.56 A10_OLINUXINO_LIME_SHIELD.2-15
R0  (via drill 0.3, 0.61 pad 0.25)
  Top 0.152: v36.42,52.88 36.42,54.25 SV6.13
  Top 0.254: U1.30 50.72,27.94 51.49,27.46 51.87,26.67 52.05,26.44 52.07,26.21 52.2,25.65 52.2,25.25 v51.51,24.41
  Bottom 0.152: 37.06,48.31 37.06,52.27 36.44,52.9 | 36.44,52.9 36.41,52.92 A10_OLINUXINO_LIME_SHIELD.1-13 | v36.42,52.88 36.44,52.9
  Bottom 0.254: 37.06,48.31 51.51,33.86 v51.51,24.41
R1  (via drill 0.3, 0.61 pad 0.25)
  Top 0.152: v37.64,52.88 37.64,54.25 SV6.15
  Top 0.254: v53.47,24.33 53.47,25.83 52.32,27.36 51.92,27.81 51.31,28.42 U1.31
  Bottom 0.152: 38.33,48.36 38.33,52.27 37.68,52.92 | 37.68,52.92 A10_OLINUXINO_LIME_SHIELD.1-15 | v37.64,52.88 37.68,52.92
  Bottom 0.254: 38.33,48.36 52.35,34.34 52.35,27.05 53.47,25.93 v53.47,24.33
R2  (via drill 0.3, 0.61 pad 0.25)
  Top 0.152: v39.01,52.88 39.01,54.25 SV6.17
  Top 0.254: v55.47,24.66 55.47,25.15 51.69,28.93 U1.32
  Bottom 0.152: 39.57,48.11 39.57,52.27 38.99,52.86 | 38.99,52.86 38.95,52.9 A10_OLINUXINO_LIME_SHIELD.1-17 | v39.01,52.88 38.99,52.86
  Bottom 0.254: 39.57,48.11 52.96,34.72 52.96,27.18 v55.47,24.66
R3  (via drill 0.3, 0.61 pad 0.25)
  Top 0.152: v40.23,52.88 40.23,54.25 SV6.19
  Top 0.254: v57.33,24.33 52.22,29.44 U1.33
  Bottom 0.152: 40.84,47.83 40.84,52.38 40.28,52.93 | 40.28,52.93 40.22,53 A10_OLINUXINO_LIME_SHIELD.1-19 | v40.23,52.88 40.28,52.93
  Bottom 0.254: 40.84,47.83 49.02,39.57 53.62,34.98 53.62,28.65 57.33,24.94 v57.33,24.33
R4  (via drill 0.3, 0.61 pad 0.25)
  Top 0.152: v41.45,52.88 41.45,54.25 SV6.21
  Top 0.254: v57.43,26.36 53.87,29.92 U1.34
  Bottom 0.152: 42.14,47.42 42.14,52.25 41.49,52.9 | 41.49,52.9 A10_OLINUXINO_LIME_SHIELD.1-21 | v41.45,52.88 41.49,52.9
  Bottom 0.254: 42.14,47.42 54.18,35.38 54.18,29.95 57.43,26.7 v57.43,26.36
R5  (via drill 0.3, 0.61 pad 0.25)
  Top 0.152: v42.82,52.88 42.82,54.25 SV6.23
  Top 0.254: v57.58,28.42 55.45,30.56 53.29,30.56 53.16,30.43 U1.35
  Bottom 0.152: 43.38,47.17 43.38,52.3 v42.81,52.87 | v42.81,52.87 42.76,52.92 A10_OLINUXINO_LIME_SHIELD.1-23 | v42.82,52.88 v42.81,52.87
  Bottom 0.254: 43.38,47.17 54.91,35.64 54.91,30.81 57.3,28.42 v57.58,28.42
R6  (via drill 0.3, 0.61 pad 0.25)
  Top 0.152: v44.04,52.88 44.04,54.25 SV6.25
  Top 0.254: v57.68,30.63 56.69,30.63 55.63,31.7 52.96,31.7 52.2,30.94 U1.36
  Bottom 0.152: 44.68,47.09 44.68,52.32 44.08,52.92 | 44.08,52.92 44.03,52.97 A10_OLINUXINO_LIME_SHIELD.1-25 | v44.04,52.88 44.08,52.92
  Bottom 0.254: 44.68,47.09 51.59,40.18 51.66,40.18 55.93,35.92 55.93,31.85 57.15,30.63 v57.68,30.63
R7  (via drill 0.3, 0.61 pad 0.25)
  Top 0.152: v45.26,52.88 45.26,54.25 SV6.27
  Top 0.254: v57.76,32.59 52.86,32.59 51.61,31.42 U1.37
  Bottom 0.152: 45.92,47.57 45.92,52.3 45.3,52.92 | 45.3,52.92 A10_OLINUXINO_LIME_SHIELD.1-27 | v45.26,52.88 45.3,52.92
  Bottom 0.254: 45.92,47.57 56.84,36.65 56.74,33.6 v57.76,32.59
RESET_N  (via drill 0.3)
  Top 0.152: v39.01,5.94 39.01,7.32 SV4.5
  Bottom 0.152: v39.01,5.94 39.01,7.32 A10_OLINUXINO_LIME_SHIELD.3-5
RX0_N
  Top 0.152: U1.91 26.34,30.43 arc-90 25.25,31.52 arc90 24.66,32.11 19.67,32.11 arc-90 19.1,32.68 19.1,32.92 arc90 18.83,33.18 18.29,33.18 arc90 18.02,32.92 18.02,32.68 arc-90 17.45,32.11 arc-90 16.33,33.22 arc90 15.8,33.76 9.68,33.76 arc90 9.4,33.48 9.4,27.84 arc90 9.87,27.37 HDMI.P$9
RX0_P
  Top 0.152: U1.90 26.14,30.94 arc-90 25.55,31.52 arc90 24.66,32.41 19.67,32.41 arc-90 19.41,32.68 19.41,32.92 arc90 18.83,33.49 18.29,33.49 arc90 17.72,32.92 17.72,32.68 arc-90 17.45,32.41 arc-90 16.64,33.22 arc90 15.8,34.06 9.68,34.06 arc90 9.09,33.48 9.09,27.38 arc90 10.11,26.37 HDMI.P$7
RX1_N
  Top 0.152: U1.86 22.81,32.92 arc-90 22.02,33.71 arc90 21.08,34.65 14.5,34.65 arc-90 13.31,35.84 13.31,36.3 arc90 12.93,36.68 9.25,36.68 arc90 8.66,36.09 8.66,26.54 arc90 9.34,25.87 HDMI.P$6
RX1_P
  Top 0.152: U1.85 22.61,33.43 arc-90 22.33,33.71 arc90 21.08,34.95 14.5,34.95 arc-90 13.61,35.84 13.61,36.3 arc90 12.93,36.98 9.25,36.98 arc90 8.36,36.09 8.36,25.83 arc90 9.32,24.87 HDMI.P$4
RX2_N
  Top 0.152: U1.81 15.57,35.43 arc-90 14.15,36.85 arc90 13.66,37.34 8.64,37.34 arc90 7.95,36.65 7.95,24.89 arc90 8.47,24.37 HDMI.P$3
RX2_P
  Top 0.152: U1.80 15.39,35.92 arc-90 14.45,36.85 arc90 13.66,37.64 8.64,37.64 arc90 7.64,36.65 7.64,24.38 arc90 8.66,23.37 HDMI.P$1
RXC_N
  Top 0.152: U1.94 25.91,28.93 arc-90 24.11,30.73 arc90 23.72,31.11 16.84,31.11 arc-90 15.49,32.46 15.49,32.59 arc90 14.99,33.1 10.59,33.1 arc90 10.16,32.66 10.16,29.39 arc90 10.68,28.87 HDMI.P$12
RXC_P
  Top 0.152: U1.93 25.7,29.44 arc-90 24.41,30.73 arc90 23.72,31.42 16.84,31.42 arc-90 15.8,32.46 15.8,32.59 arc90 14.99,33.4 10.59,33.4 arc90 9.86,32.66 9.86,28.85 arc90 10.84,27.87 HDMI.P$10
SDC3_CLK/PI5  (via drill 0.3)
  Top 0.152: v40.23,12.19 SV3.19
  Bottom 0.152: v40.23,12.19 40.23,13.56 A10_OLINUXINO_LIME_SHIELD.2-19
SDC3_CMD/PI4  (via drill 0.3)
  Top 0.152: v39.01,12.19 39.01,13.56 SV3.17
  Bottom 0.152: v39.01,12.19 39.01,13.56 A10_OLINUXINO_LIME_SHIELD.2-17
SDC3_D0/PI6  (via drill 0.3)
  Top 0.152: v41.45,12.19 41.45,13.56 SV3.21
  Bottom 0.152: v41.45,12.19 41.45,13.56 A10_OLINUXINO_LIME_SHIELD.2-21
SDC3_D1/PI7  (via drill 0.3)
  Top 0.152: v42.82,15.09 42.82,13.72 SV3.23
  Bottom 0.152: v42.82,15.09 42.82,13.72 A10_OLINUXINO_LIME_SHIELD.2-23
SDC3_D2/PI8  (via drill 0.3)
  Top 0.152: v44.04,12.19 SV3.25
  Bottom 0.152: v44.04,12.19 44.04,13.56 A10_OLINUXINO_LIME_SHIELD.2-25
SDC3_D3/PI9  (via drill 0.3)
  Top 0.152: v45.26,12.19 45.26,13.56 SV3.27
  Bottom 0.152: v45.26,12.19 45.26,13.56 A10_OLINUXINO_LIME_SHIELD.2-27
SPI0_CLK/UART5_RX/EINT23/PI11  (via drill 0.3)
  Top 0.152: v47.85,12.19 SV3.31
  Bottom 0.152: v47.85,12.19 47.85,13.56 A10_OLINUXINO_LIME_SHIELD.2-31
SPI0_CS0/PC23  (via drill 0.3)
  Top 0.152: v52.88,48.77 52.88,50.14 SV6.40
  Bottom 0.152: v52.88,48.77 52.88,50.14 A10_OLINUXINO_LIME_SHIELD.1-40
SPI0_CS0/UART5_TX/EINT22/PI10  (via drill 0.3)
  Top 0.152: v46.63,12.19 46.63,13.56 SV3.29
  Bottom 0.152: v46.63,12.19 46.63,13.56 A10_OLINUXINO_LIME_SHIELD.2-29
SPI0_MISO/UART6_RX/EINT25/PI13  (via drill 0.3)
  Top 0.152: v50.44,12.19 50.44,13.56 SV3.35
  Bottom 0.152: v50.44,12.19 50.44,13.56 A10_OLINUXINO_LIME_SHIELD.2-35
SPI0_MOSI/UART6_TX/EINT24/PI12  (via drill 0.3)
  Top 0.152: v49.07,15.09 49.07,13.72 SV3.33
  Bottom 0.152: v49.07,15.09 49.07,13.72 A10_OLINUXINO_LIME_SHIELD.2-33
SPI2_CS1/SPDIF_DO/PB13  (via drill 0.3)
  Top 0.152: v50.44,4.72 50.44,3.35 SV4.24
  Bottom 0.152: v50.44,4.72 50.44,3.35 A10_OLINUXINO_LIME_SHIELD.3-24
TS0_CLK/CSI0_PCLK/PE0  (via drill 0.3)
  Top 0.152: v31.39,11.12 31.39,9.75 SV3.6
  Bottom 0.152: v31.39,11.12 31.39,9.75 A10_OLINUXINO_LIME_SHIELD.2-6
TS0_D0/CSI0_D0/PE4  (via drill 0.3)
  Top 0.152: v36.42,11.12 SV3.14
  Bottom 0.152: v36.42,11.12 36.42,9.75 A10_OLINUXINO_LIME_SHIELD.2-14
TS0_D1/CSI0_D1/PE5  (via drill 0.3)
  Top 0.152: v37.64,11.12 37.64,9.75 SV3.16
  Bottom 0.152: v37.64,11.12 37.64,9.75 A10_OLINUXINO_LIME_SHIELD.2-16
TS0_D2/CSI0_D2/PE6  (via drill 0.3)
  Top 0.152: v39.01,11.12 39.01,9.75 SV3.18
  Bottom 0.152: v39.01,11.12 39.01,9.75 A10_OLINUXINO_LIME_SHIELD.2-18
TS0_D3/CSI0_D3/PE7  (via drill 0.3)
  Top 0.152: v40.23,11.12 SV3.20
  Bottom 0.152: v40.23,11.12 40.23,9.75 A10_OLINUXINO_LIME_SHIELD.2-20
TS0_D4/CSI0_D4/PE8  (via drill 0.3)
  Top 0.152: v41.45,11.12 41.45,9.75 SV3.22
  Bottom 0.152: v41.45,11.12 41.45,9.75 A10_OLINUXINO_LIME_SHIELD.2-22
TS0_D5/CSI0_D5/PE9  (via drill 0.3)
  Top 0.152: v42.82,11.12 42.82,9.75 SV3.24
  Bottom 0.152: v42.82,11.12 42.82,9.75 A10_OLINUXINO_LIME_SHIELD.2-24
TS0_D6/CSI0_D6/PE10  (via drill 0.3)
  Top 0.152: v44.04,11.12 SV3.26
  Bottom 0.152: v44.04,11.12 44.04,9.75 A10_OLINUXINO_LIME_SHIELD.2-26
TS0_D7/CSI0_D7/PE11  (via drill 0.3)
  Top 0.152: v45.26,11.12 45.26,9.75 SV3.28
  Bottom 0.152: v45.26,11.12 45.26,9.75 A10_OLINUXINO_LIME_SHIELD.2-28
TS0_DVLD/CSI0_VSYNC/PE3  (via drill 0.3)
  Top 0.152: v35.2,11.12 35.2,9.75 SV3.12
  Bottom 0.152: v35.2,11.12 35.2,9.75 A10_OLINUXINO_LIME_SHIELD.2-12
TS0_ERR/CSI0_MCLK/PE1  (via drill 0.3)
  Top 0.152: v32.61,11.12 SV3.8
  Bottom 0.152: v32.61,11.12 32.61,9.75 A10_OLINUXINO_LIME_SHIELD.2-8
TS0_SYNC/CSI0_HSYNC/PE2  (via drill 0.3)
  Top 0.152: v33.83,11.12 33.83,9.75 SV3.10
  Bottom 0.152: v33.83,11.12 33.83,9.75 A10_OLINUXINO_LIME_SHIELD.2-10
TS1_CLK/CSI1_PCLK/SDC1_CMD/PG0  (via drill 0.3)
  Top 0.152: v31.39,52.88 31.39,54.25 SV6.5
  Bottom 0.152: v31.39,52.88 31.39,54.25 A10_OLINUXINO_LIME_SHIELD.1-5
TS1_DVLD/CSI1_VSYNC/SDC1_D1/PG3  (via drill 0.3)
  Top 0.152: v35.2,52.88 35.2,54.25 SV6.11
  Bottom 0.152: v35.2,52.88 35.2,54.25 A10_OLINUXINO_LIME_SHIELD.1-11
TS1_ERR/CSI1_MLCK/SDC1_CLK/PG1  (via drill 0.3)
  Top 0.152: v32.61,52.88 32.61,54.25 SV6.7
  Bottom 0.152: v32.61,52.88 32.61,54.25 A10_OLINUXINO_LIME_SHIELD.1-7
TS1_SYNC/CSI1_HSYNC/SDC1_D0/PG2  (via drill 0.3)
  Top 0.152: v33.83,52.88 33.83,54.25 SV6.9
  Bottom 0.152: v33.83,52.88 33.83,54.25 A10_OLINUXINO_LIME_SHIELD.1-9
TVOUT0/VGA-G  (via drill 0.3)
  Top 0.152: v40.23,51.66 40.23,50.29 SV6.20
  Bottom 0.152: v40.23,51.66 40.23,50.29 A10_OLINUXINO_LIME_SHIELD.1-20
TVOUT1/VGA-B  (via drill 0.3)
  Top 0.152: v41.45,51.66 41.45,50.29 SV6.22
  Bottom 0.152: v41.45,51.66 41.45,50.29 A10_OLINUXINO_LIME_SHIELD.1-22
TVOUT2/VGA-R  (via drill 0.3)
  Top 0.152: v42.82,51.66 42.82,50.29 SV6.24
  Bottom 0.152: v42.82,51.66 42.82,50.29 A10_OLINUXINO_LIME_SHIELD.1-24
TWI0_SCK/PB0  (via drill 0.3)
  Top 0.152: v31.39,12.19 31.39,13.56 SV3.5
  Bottom 0.152: v31.39,12.19 31.39,13.56 A10_OLINUXINO_LIME_SHIELD.2-5
TWI0_SDA/PB1  (via drill 0.3)
  Top 0.152: v32.61,12.19 SV3.7
  Bottom 0.152: v32.61,12.19 32.61,13.56 A10_OLINUXINO_LIME_SHIELD.2-7
TWI1_SCK/PB18  (via drill 0.3)
  Top 0.152: v50.44,51.66 50.44,50.29 SV6.36
  Bottom 0.152: v50.44,51.66 50.44,50.29 A10_OLINUXINO_LIME_SHIELD.1-36
TWI1_SDA/PB19  (via drill 0.3)
  Top 0.152: v49.07,51.66 49.07,50.29 SV6.34
  Bottom 0.152: v49.07,51.66 49.07,50.29 A10_OLINUXINO_LIME_SHIELD.1-34
TWI2_SCK/PB20  (via drill 0.3)
  Top 0.152: v47.85,51.66 47.85,50.29 SV6.32
  Bottom 0.152: v47.85,51.66 47.85,50.29 A10_OLINUXINO_LIME_SHIELD.1-32
TWI2_SDA/PB21  (via drill 0.3)
  Top 0.152: v46.63,51.66 46.63,50.29 SV6.30
  Bottom 0.152: v46.63,51.66 46.63,50.29 A10_OLINUXINO_LIME_SHIELD.1-30
UART0_RX/IR1_RX/PB23  (via drill 0.3)
  Top 0.152: v44.04,51.66 44.04,50.29 SV6.26
  Bottom 0.152: v44.04,51.66 44.04,50.29 A10_OLINUXINO_LIME_SHIELD.1-26
UART0_TX/IR1_TX/PB22  (via drill 0.3)
  Top 0.152: v45.26,51.66 45.26,50.29 SV6.28
  Bottom 0.152: v45.26,51.66 45.26,50.29 A10_OLINUXINO_LIME_SHIELD.1-28
VCC  (via drill 0.3, 0.61 pad 0.25)
  Top 0.152: v21.59,21.59 21.59,20.32 25.4,20.32 L4.1 | v22.86,30.48 v22.86,25.4 | v16.51,36.83 15.24,36.83 v15.24,48.26 | v37.8,4.72 37.8,5.64 37.64,5.79 37.64,7.32 SV4.3 | v30.02,55.78 30.02,54.41 SV6.3 | v15.85,22.55 15.85,24.08 IC1.8
  Top 0.254: L4.1 25.3,20.3 | 27.03,39.29 27.13,39.4 27.15,39.4
  Top 0.406: L1.1 24.7,42.91 25.3,42.32 25.3,41.02 27.03,39.29 L3.1 | 24.26,46.43 22.89,47.8 v16.66,47.8 | R4.2 29.64,18.64 30.28,18.01 30.68,18.01 33.29,18.01 R2.2 | L2.1 27.89,47.1 24.93,47.1
  Top 0.61: 30.28,18.01 28.07,18.01 27.06,17 | R3.2 31.2,18.53 30.68,18.01
  Top 0.813: L4.1 25.62,18.45 27.06,17 v27.46,16.61
  Top 1.016: L1.1 24.26,43.06 24.26,46.43 24.46,46.23
  Top 1.27: 24.26,46.43 24.93,47.1 25.81,47.98 25.81,54.99 26.14,55.32 26.14,56.97 27.43,58.27 v30.12,58.27
  Bottom 0.152: 21.59,22.86 21.59,24.13 v22.86,25.4 | 21.59,22.86 v21.59,21.59 | v16.51,36.83 v22.86,30.48 | v15.24,48.26 15.24,49.53 A10_OLINUXINO_LIME_SHIELD.4-1 | v37.8,4.72 37.8,5.64 37.64,5.79 37.64,5.94 37.44,5.94 | v30.02,55.78 30.06,55.78 | v15.85,22.55 16.15,22.86 21.59,22.86 | 21.64,22.86 21.59,22.86
  Bottom 0.254: v30.12,58.27 30.06,58.2 30.06,55.78 A10_OLINUXINO_LIME_SHIELD.1-3
  Bottom 0.406: v16.66,47.8 15.58,48.88 A10_OLINUXINO_LIME_SHIELD.4-1 | A10_OLINUXINO_LIME_SHIELD.3-3 37.44,7.11 37.44,5.94 37.44,5.38 37.31,5.51 31.52,5.51 29.97,7.06 27.58,7.06 27.46,7.19 v27.46,16.61
  Bottom 0.813: v27.46,16.61 29.21,16.61 30,15.82
VMIC  (via drill 0.3)
  Top 0.152: v35.2,51.66 35.2,50.29 SV6.12
  Bottom 0.152: v35.2,51.66 35.2,50.29 A10_OLINUXINO_LIME_SHIELD.1-12
VSYNC  (via drill 0.3, 0.61 pad 0.25)
  Top 0.152: v60.66,4.72 60.5,4.57 60.5,3.35 SV4.40
  Top 0.254: v62.61,30.86 62.61,34.37 59.82,37.16 51.77,37.16 51.03,36.42 U1.47
  Bottom 0.152: v60.66,4.72 60.74,4.64
  Bottom 0.254: A10_OLINUXINO_LIME_SHIELD.3-40 60.54,4.43 60.74,4.64 61.52,5.41 61.52,8.28 63.65,10.41 63.65,29.82 v62.61,30.86
XN_TP  (via drill 0.3)
  Top 0.152: v59.28,55.17 59.28,56.54 SV5.38
  Bottom 0.152: v59.28,55.17 59.28,56.54 A10_OLINUXINO_LIME_SHIELD.D-38
XP_TP  (via drill 0.3)
  Top 0.152: v59.28,62.18 59.28,60.81 SV5.37
  Bottom 0.152: v59.28,62.18 59.28,60.81 A10_OLINUXINO_LIME_SHIELD.D-37
YN_TP  (via drill 0.3)
  Top 0.152: v60.66,58.06 60.66,56.69 SV5.40
  Bottom 0.152: v60.66,58.06 60.5,57.91 60.5,56.69 A10_OLINUXINO_LIME_SHIELD.D-40
YP_TP  (via drill 0.3)
  Top 0.152: v60.66,62.18 60.66,60.81 SV5.39
  Bottom 0.152: v60.66,62.18 60.5,62.03 60.5,60.81 A10_OLINUXINO_LIME_SHIELD.D-39
(copper drawn outside any net)
  shapes: Top area x2

## Text on the board
Top: HDMI Input Board v.1.0 / Manishi Barosee / theiopage.blogspot.de
_tsilk: Kalypso Avionica GmBH | 2014